# Altium schematic sheet receiver_car_2S_A.SchDoc
size A3
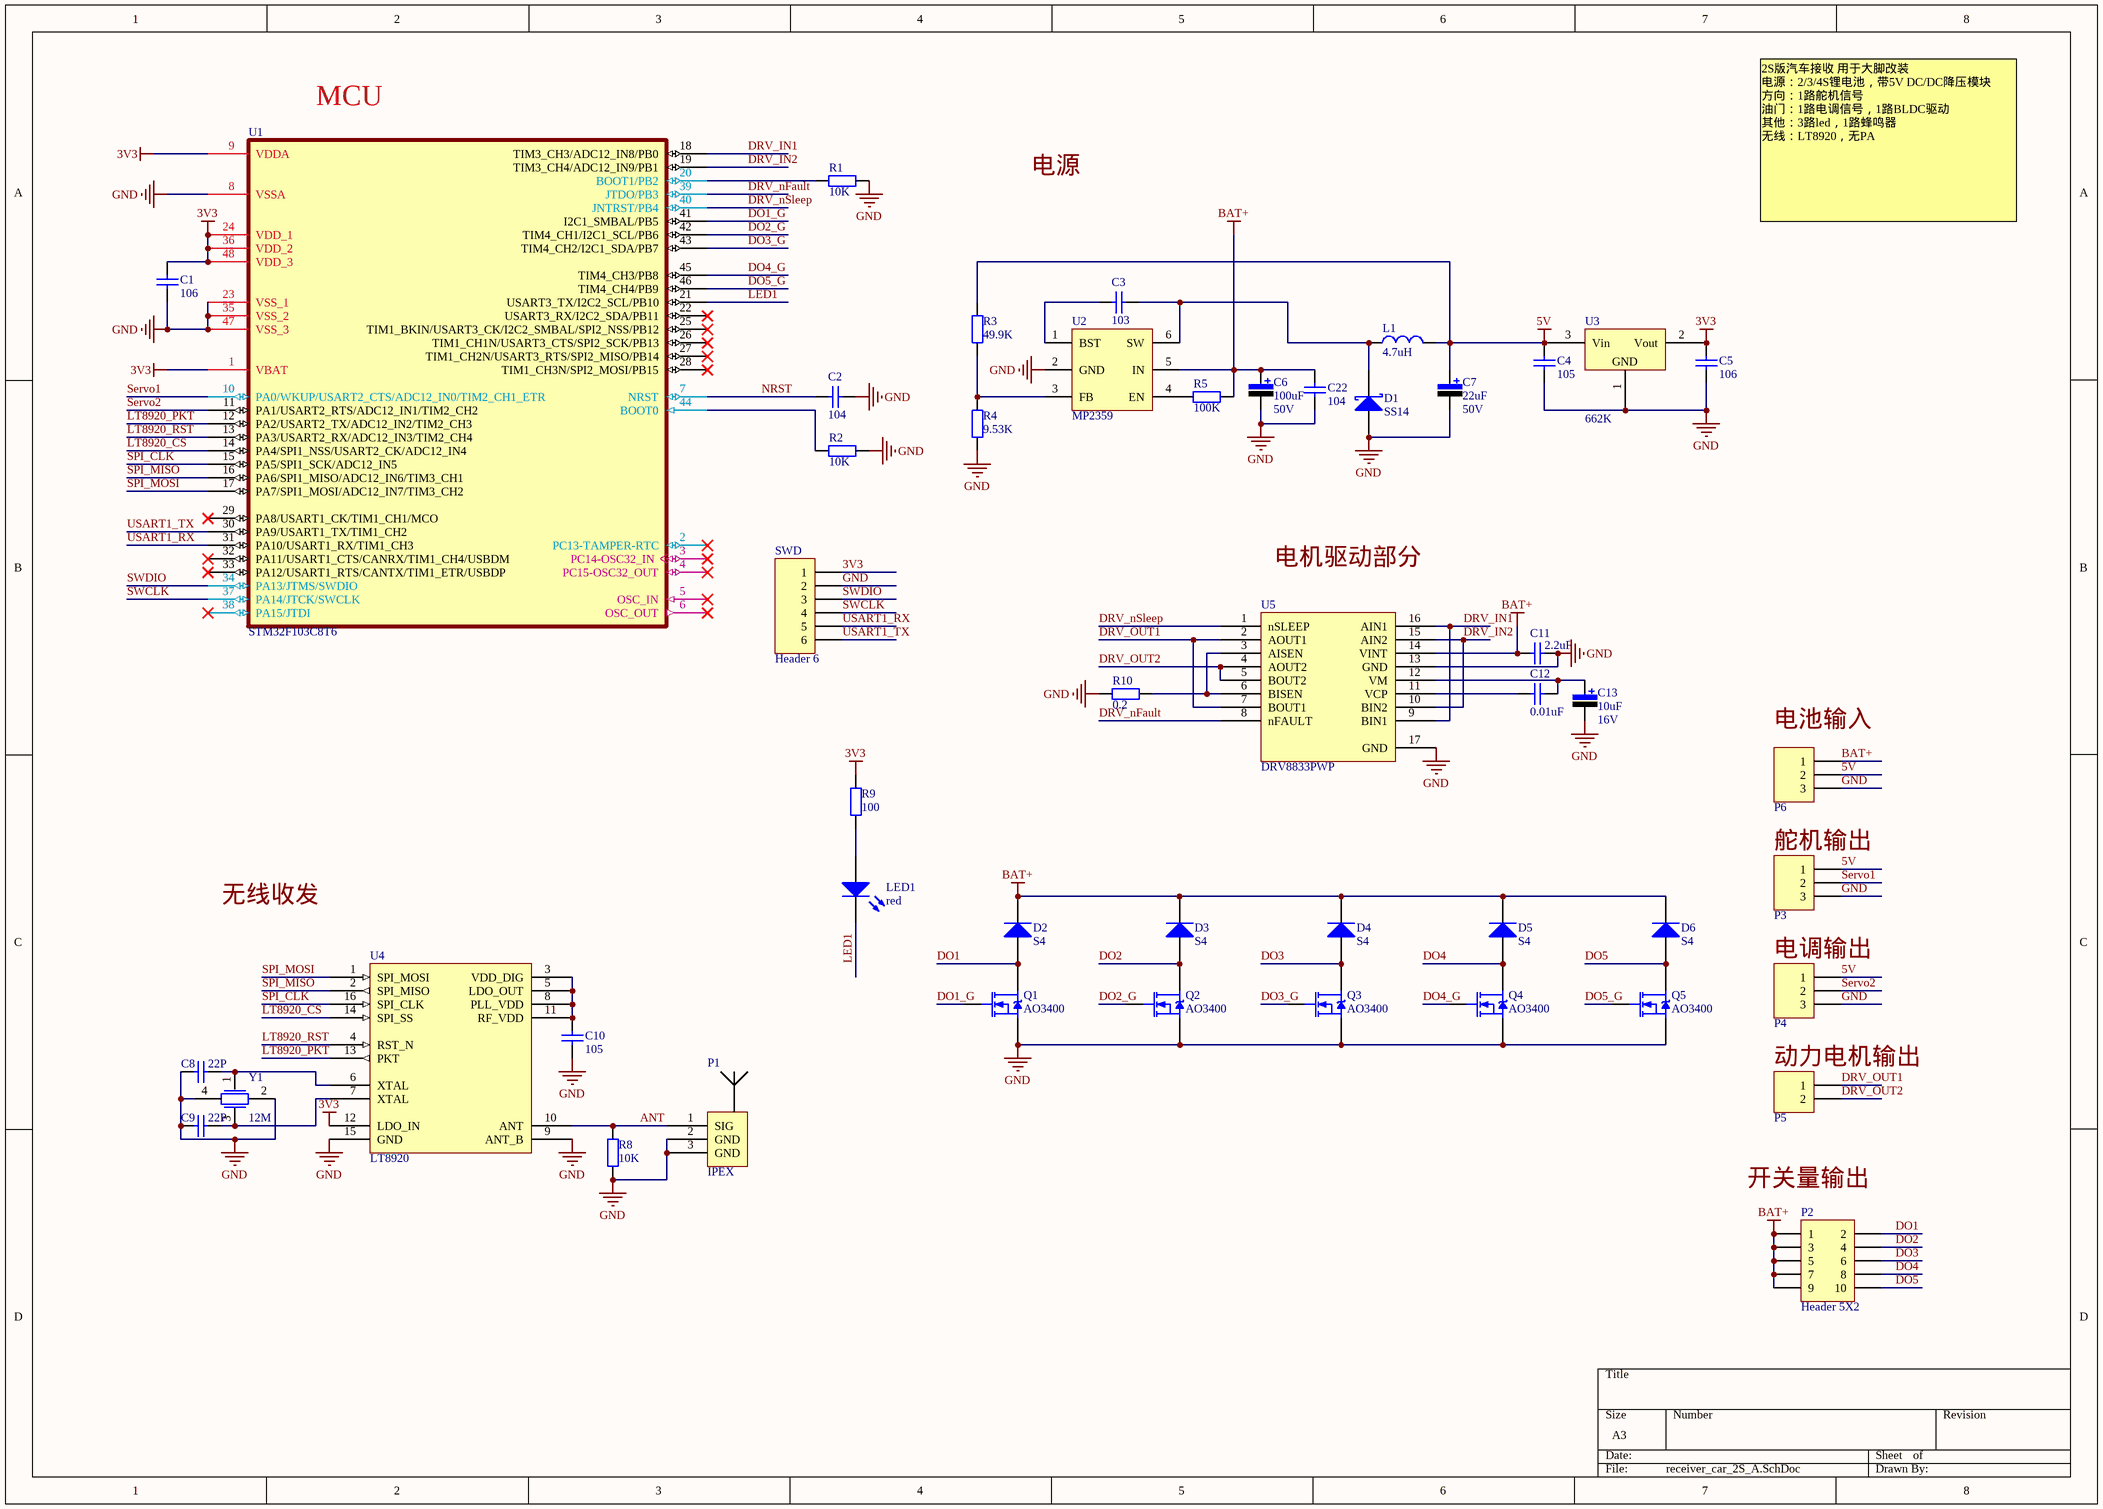
[diagram p0: receiver_car_2S_A.SchDoc]

## Parts
C1  106  [0805-2]
C2  value 104  [0805-2]  (hidden comment: Cap)
C3  103  [0805-2]
C4  value 105  [0805-2]  (hidden comment: Cap)
C5  value 106  [0805-2]  (hidden comment: Cap)
C6  value 100uF  Vol: 50V  [C-RB-S6]  (hidden comment: Cap Pol)
C7  value 22uF  Vol: 50V  [C-RB-S6]  (hidden comment: Cap Pol)
C8  value 22P  [0805-2]  (hidden comment: Cap)
C9  value 22P  [0805-2]  (hidden comment: Cap)
C10  value 105  [0805-2]  (hidden comment: Cap)
C11  value 2.2uF  [0805-2]  (hidden comment: Cap)
C12  value 0.01uF  [0805-2]  (hidden comment: Cap)
C13  value 10uF  Vol: 16V  [CAP-3216]  (hidden comment: Cap Pol)
C22  104  [0805-2]
D1  Type: SS14  [DIODE-SMA]  (hidden comment: D-Schottky)
D2  Type: S4  [SOD523]  (hidden comment: Diode)
D3  Type: S4  [SOD523]  (hidden comment: Diode)
D4  Type: S4  [SOD523]  (hidden comment: Diode)
D5  Type: S4  [SOD523]  (hidden comment: Diode)
D6  Type: S4  [SOD523]  (hidden comment: Diode)
L1  value 4.7uH  [l-SMD-4]  (hidden comment: Inductor)
LED1  red  [0603-1]
P1  IPEX  [U.FL-R-SMT]
P2  Header 5X2  [HDR5X2_A1]
P3  Header 3  [HDR3X1_A]  (value not drawn)
P4  Header 3  [HDR3X1_A]  (value not drawn)
P5  Header 2  [HDR2X1_A]  (value not drawn)
P6  Header 3  [HDR3X1_A]  (value not drawn)
Q1  AO3400  [SOT-23-3L]
Q2  AO3400  [SOT-23-3L]
Q3  AO3400  [SOT-23-3L]
Q4  AO3400  [SOT-23-3L]
Q5  AO3400  [SOT-23-3L]
R1  value 10K  [0805-2]  (hidden comment: Res1)
R2  value 10K  [0805-2]  (hidden comment: Res1)
R3  value 49.9K  [0805-2]  (hidden comment: Res1)
R4  value 9.53K  [0805-2]  (hidden comment: Res1)
R5  value 100K  [0805-2]  (hidden comment: Res1)
R8  value 10K  [0805-2]  (hidden comment: Res1)
R9  value 100  [0805-2]  (hidden comment: Res1)
R10  value 0.2  [0805-2]  (hidden comment: Res1)
SWD  Header 6  [HDR6*1*1.27]
U1  STM32F103C8T6  [STM-LQFP48_N]
U2  MP2359  [TSOT23-6]
U3  662K  [SOT-23]
U4  LT8920  [SSOP-16 LT8920]
U5  DRV8833PWP  [HTSSOP-16 DRV8833]
Y1  12M  [XTAL_3225]

## Nets
3V3: C1.2 C5.1 R9.2 SWD.1 U1.1(VBAT) U1.9(VDDA) U1.24(VDD_1) U1.36(VDD_2) U1.48(VDD_3) U3.2(Vout) U4.12(LDO_IN)
5V: C4.1 C7.1 L1.2 P3.1 P4.1 P6.2 R3.1 U3.3(Vin)
BAT+: C6.1 C11.2 C22.2 D2.2(K) D3.2(K) D4.2(K) D5.2(K) D6.2(K) P2.1 P2.3 P2.5 P2.7 P2.9 P6.1 R5.1 U2.5(IN) U5.14(VINT)
GND: C1.1 C2.2 C4.2 C5.2 C6.2 C7.2 C8.1 C9.1 C10.1 C11.1 C13.2 C22.1 D1.1(A) P1.2(GND) P1.3(GND) P3.3 P4.3 P6.3 Q1.S Q2.S Q3.S Q4.S Q5.S R1.2 R2.1 R4.2 R8.1 R10.2 SWD.2 U1.8(VSSA) U1.23(VSS_1) U1.35(VSS_2) U1.47(VSS_3) U2.2(GND) U3.1(Vss) U4.9(ANT_B) U4.15(GND) U5.13(GND) U5.17(GND) Y1.2 Y1.4
ANT: P1.1(SIG) R8.2 U4.10(ANT)
DO1: D2.1(A) P2.2 Q1.D
DO1_G: Q1.G U1.41(I2C1_SMBAL/PB5)
DO2: D3.1(A) P2.4 Q2.D
DO2_G: Q2.G U1.42(TIM4_CH1/I2C1_SCL/PB6)
DO3: D4.1(A) P2.6 Q3.D
DO3_G: Q3.G U1.43(TIM4_CH2/I2C1_SDA/PB7)
DO4: D5.1(A) P2.8 Q4.D
DO4_G: Q4.G U1.45(TIM4_CH3/PB8)
DO5: D6.1(A) P2.10 Q5.D
DO5_G: Q5.G U1.46(TIM4_CH4/PB9)
DRV_IN1: U1.18(TIM3_CH3/ADC12_IN8/PB0) U5.9(BIN1) U5.16(AIN1)
DRV_IN2: U1.19(TIM3_CH4/ADC12_IN9/PB1) U5.10(BIN2) U5.15(AIN2)
DRV_nFault: U1.39(JTDO/PB3) U5.8(nFAULT)
DRV_nSleep: U1.40(JNTRST/PB4) U5.1(nSLEEP)
DRV_OUT1: P5.1 U5.2(AOUT1) U5.7(BOUT1)
DRV_OUT2: P5.2 U5.4(AOUT2) U5.5(BOUT2)
LED1: LED1.2(K) U1.21(USART3_TX/I2C2_SCL/PB10)
LT8920_CS: U1.14(PA4/SPI1_NSS/USART2_CK/ADC12_IN4) U4.14(SPI_SS)
LT8920_PKT: U1.12(PA2/USART2_TX/ADC12_IN2/TIM2_CH3) U4.13(PKT)
LT8920_RST: U1.13(PA3/USART2_RX/ADC12_IN3/TIM2_CH4) U4.4(RST_N)
NRST: C2.1 U1.7(NRST)
Servo1: P3.2 U1.10(PA0/WKUP/USART2_CTS/ADC12_IN0/TIM2_CH1_ETR)
Servo2: P4.2 U1.11(PA1/USART2_RTS/ADC12_IN1/TIM2_CH2)
SPI_CLK: U1.15(PA5/SPI1_SCK/ADC12_IN5) U4.16(SPI_CLK)
SPI_MISO: U1.16(PA6/SPI1_MISO/ADC12_IN6/TIM3_CH1) U4.2(SPI_MISO)
SPI_MOSI: U1.17(PA7/SPI1_MOSI/ADC12_IN7/TIM3_CH2) U4.1(SPI_MOSI)
SWCLK: SWD.4 U1.37(PA14/JTCK/SWCLK)
SWDIO: SWD.3 U1.34(PA13/JTMS/SWDIO)
USART1_RX: SWD.5 U1.31(PA10/USART1_RX/TIM1_CH3)
USART1_TX: SWD.6 U1.30(PA9/USART1_TX/TIM1_CH2)
NetC3_1: C3.1 U2.1(BST)
NetC3_2: C3.2 D1.2(K) L1.1 U2.6(SW)
NetC8_2: C8.2 U4.6(XTAL) Y1.1
NetC9_2: C9.2 U4.7(XTAL) Y1.3
NetC10_2: C10.2 U4.3(VDD_DIG) U4.5(LDO_OUT) U4.8(PLL_VDD) U4.11(RF_VDD)
NetC12_1: C12.1 C13.1 U5.12(VM)
NetC12_2: C12.2 U5.11(VCP)
NetLED1_1: LED1.1(A) R9.1
NetR1_1: R1.1 U1.20(BOOT1/PB2)
NetR2_2: R2.2 U1.44(BOOT0)
NetR3_2: R3.2 R4.1 U2.3(FB)
NetR5_2: R5.2 U2.4(EN)
NetR10_1: R10.1 U5.3(AISEN) U5.6(BISEN)

Not connected (* = marked no-connect by the designer): U1 2(PC13-TAMPER-RTC)* 3(PC14-OSC32_IN)* 4(PC15-OSC32_OUT)* 5(OSC_IN)* 6(OSC_OUT)* 22(USART3_RX/I2C2_SDA/PB11)* 25(TIM1_BKIN/USART3_CK/I2C2_SMBAL/SPI2_NSS/PB12)* 26(TIM1_CH1N/USART3_CTS/SPI2_SCK/PB13)* 27(TIM1_CH2N/USART3_RTS/SPI2_MISO/PB14)* 28(TIM1_CH3N/SPI2_MOSI/PB15)* 29(PA8/USART1_CK/TIM1_CH1/MCO)* 32(PA11/USART1_CTS/CANRX/TIM1_CH4/USBDM)* 33(PA12/USART1_RTS/CANTX/TIM1_ETR/USBDP)* 38(PA15/JTDI)*

## Notes on the sheet
- (near U1) MCU
- 电源
- 2S版汽车接收 用于大脚改装
  电源：2/3/4S锂电池，带5V DC/DC降压模块
  方向：1路舵机信号
  油门：1路电调信号，1路BLDC驱动
  其他：3路led，1路蜂鸣器
  无线：LT8920，无PA
- 电机驱动部分
- (near P6) 电池输入
- (near P3) 舵机输出
- 无线收发
- (near P4) 电调输出
- (near P5) 动力电机输出
- (near P2) 开关量输出
- (in symbol 662K) GND

## Library data of the parts
C1 C3 = Cap Semi: Capacitor (Semiconductor SIM Model); Published: 8-Jun-2000; LatestRevisionDate: 29-May-2009; LatestRevisionNote: IPC-7351 Footprint Added.; PackageReference: C1206; Publisher: Altium Limited; PackageDescription: Chip Capacitor
  C1: Value: 106
  C3: Value: 103
C2 C4 C5 C8-C12 = Cap: 无极性电容; Published: 8-Jun-2000; LatestRevisionDate: 17-Jul-2002; LatestRevisionNote: Re-released for DXP Platform.; PackageReference: RAD-0.3; Publisher: Altium Limited
C6 C7 C13 = Cap Pol: 极性电解电容; Published: 8-Jun-2000; LatestRevisionDate: 17-Jul-2002; LatestRevisionNote: Re-released for DXP Platform.; PackageReference: RB7.6-15; Publisher: Altium Limited
C22 = Cap Semi: Capacitor (Semiconductor SIM Model); Value: 106; Published: 8-Jun-2000; LatestRevisionDate: 29-May-2009; LatestRevisionNote: IPC-7351 Footprint Added.; PackageReference: C1206; Publisher: Altium Limited; PackageDescription: Chip Capacitor
D1 = D-Schottky: 肖特基二极管; Published: 8-Jun-2000; LatestRevisionDate: 17-Jul-2002; LatestRevisionNote: Re-released for DXP Platform.; PackageReference: SMB; Publisher: Altium Limited; Code_JEDEC: DO-214-AA
D2-D6 = Diode: 二极管; Published: 8-Jun-2000; LatestRevisionDate: 17-Jul-2002; LatestRevisionNote: Re-released for DXP Platform.; PackageDocument: Sep-1996; PackageReference: SMC; Publisher: Altium Limited; Code_JEDEC: DO-214-AB
L1 = Inductor: 电感; Code_IEC: 1005; Published: 8-Jun-2000; LatestRevisionDate: 17-Jul-2002; LatestRevisionNote: Re-released for DXP Platform.; PackageReference: 0402-A; Publisher: Altium Limited; Code_JEITA: 0402
LED1 = LED3: Typical BLUE SiC LED; Published: 8-Jun-2000; LatestRevisionDate: 17-Dec-2003; LatestRevisionNote: PCB Footprint replaced.; DatasheetVersion: 16-Apr-2002; PackageVersion: 16-Apr-2002; PackageReference: 3.5X2.8X1.9; Publisher: Altium Limited; PackageDescription: SM LED; 2 C-Bend Leads; Body 3.5 x 2.8 x 1.9 mm, inc leads (LxWxH typ)
P1 = IPEX: U.FL-R-SMT
P2 = Header 5X2: 接插件; LatestRevisionDate: 17-Jul-2002; LatestRevisionNote: Re-released for DXP Platform.; Publisher: Altium Limited
P3 P4 P6 = Header 3: 接插件; LatestRevisionDate: 17-Jul-2002; LatestRevisionNote: Re-released for DXP Platform.; Publisher: Altium Limited
P5 = Header 2: 接插件; LatestRevisionDate: 17-Jul-2002; LatestRevisionNote: Re-released for DXP Platform.; Publisher: Altium Limited
Q1-Q5 = MOSFET-N: N-Channel MOSFET; PackageDocument: 1995/1996; Published: 8-Jun-2000; LatestRevisionDate: 17-Jul-2002; LatestRevisionNote: Re-released for DXP Platform.; PackageReference: E3; Publisher: Altium Limited
R1-R5 R8-R10 = Res1: 贴片电阻; Published: 8-Jun-2000; LatestRevisionDate: 17-Jul-2002; LatestRevisionNote: Re-released for DXP Platform.; PackageReference: AXIAL-0.4; Publisher: Altium Limited
SWD = Header 6: 接插件; LatestRevisionDate: 17-Jul-2002; LatestRevisionNote: Re-released for DXP Platform.; Publisher: Altium Limited
U1 = STM32F103C8T6: STM32 ARM-based 32-bit MCU with 64 Kbytes Flash, 48-pin LQFP, Industrial Temperature; Published: *; DatasheetVersion: *; PackageVersion: *; PackageReference: *; Publisher: *; PackageDescription: *; ComponentLink1Description: *; ComponentLink1URL: *; ComponentLink2Description: *; ComponentLink2URL: *
U5 = DRV8833PWP: DRV8833_HTSSOP封装
Y1 = XTAL-4PIN: 贴片晶振